# Altium schematic sheet logic_cpu_power.SchDoc: mcHF Pro Transceiver UI board
size A3; Author: Krassi Atanassov; CompanyName: MØNKA; Engineer: For radio amateurs experimentation, non-commercial use only. Thank you!; Revision: 0.8.2; SheetTotal: 18
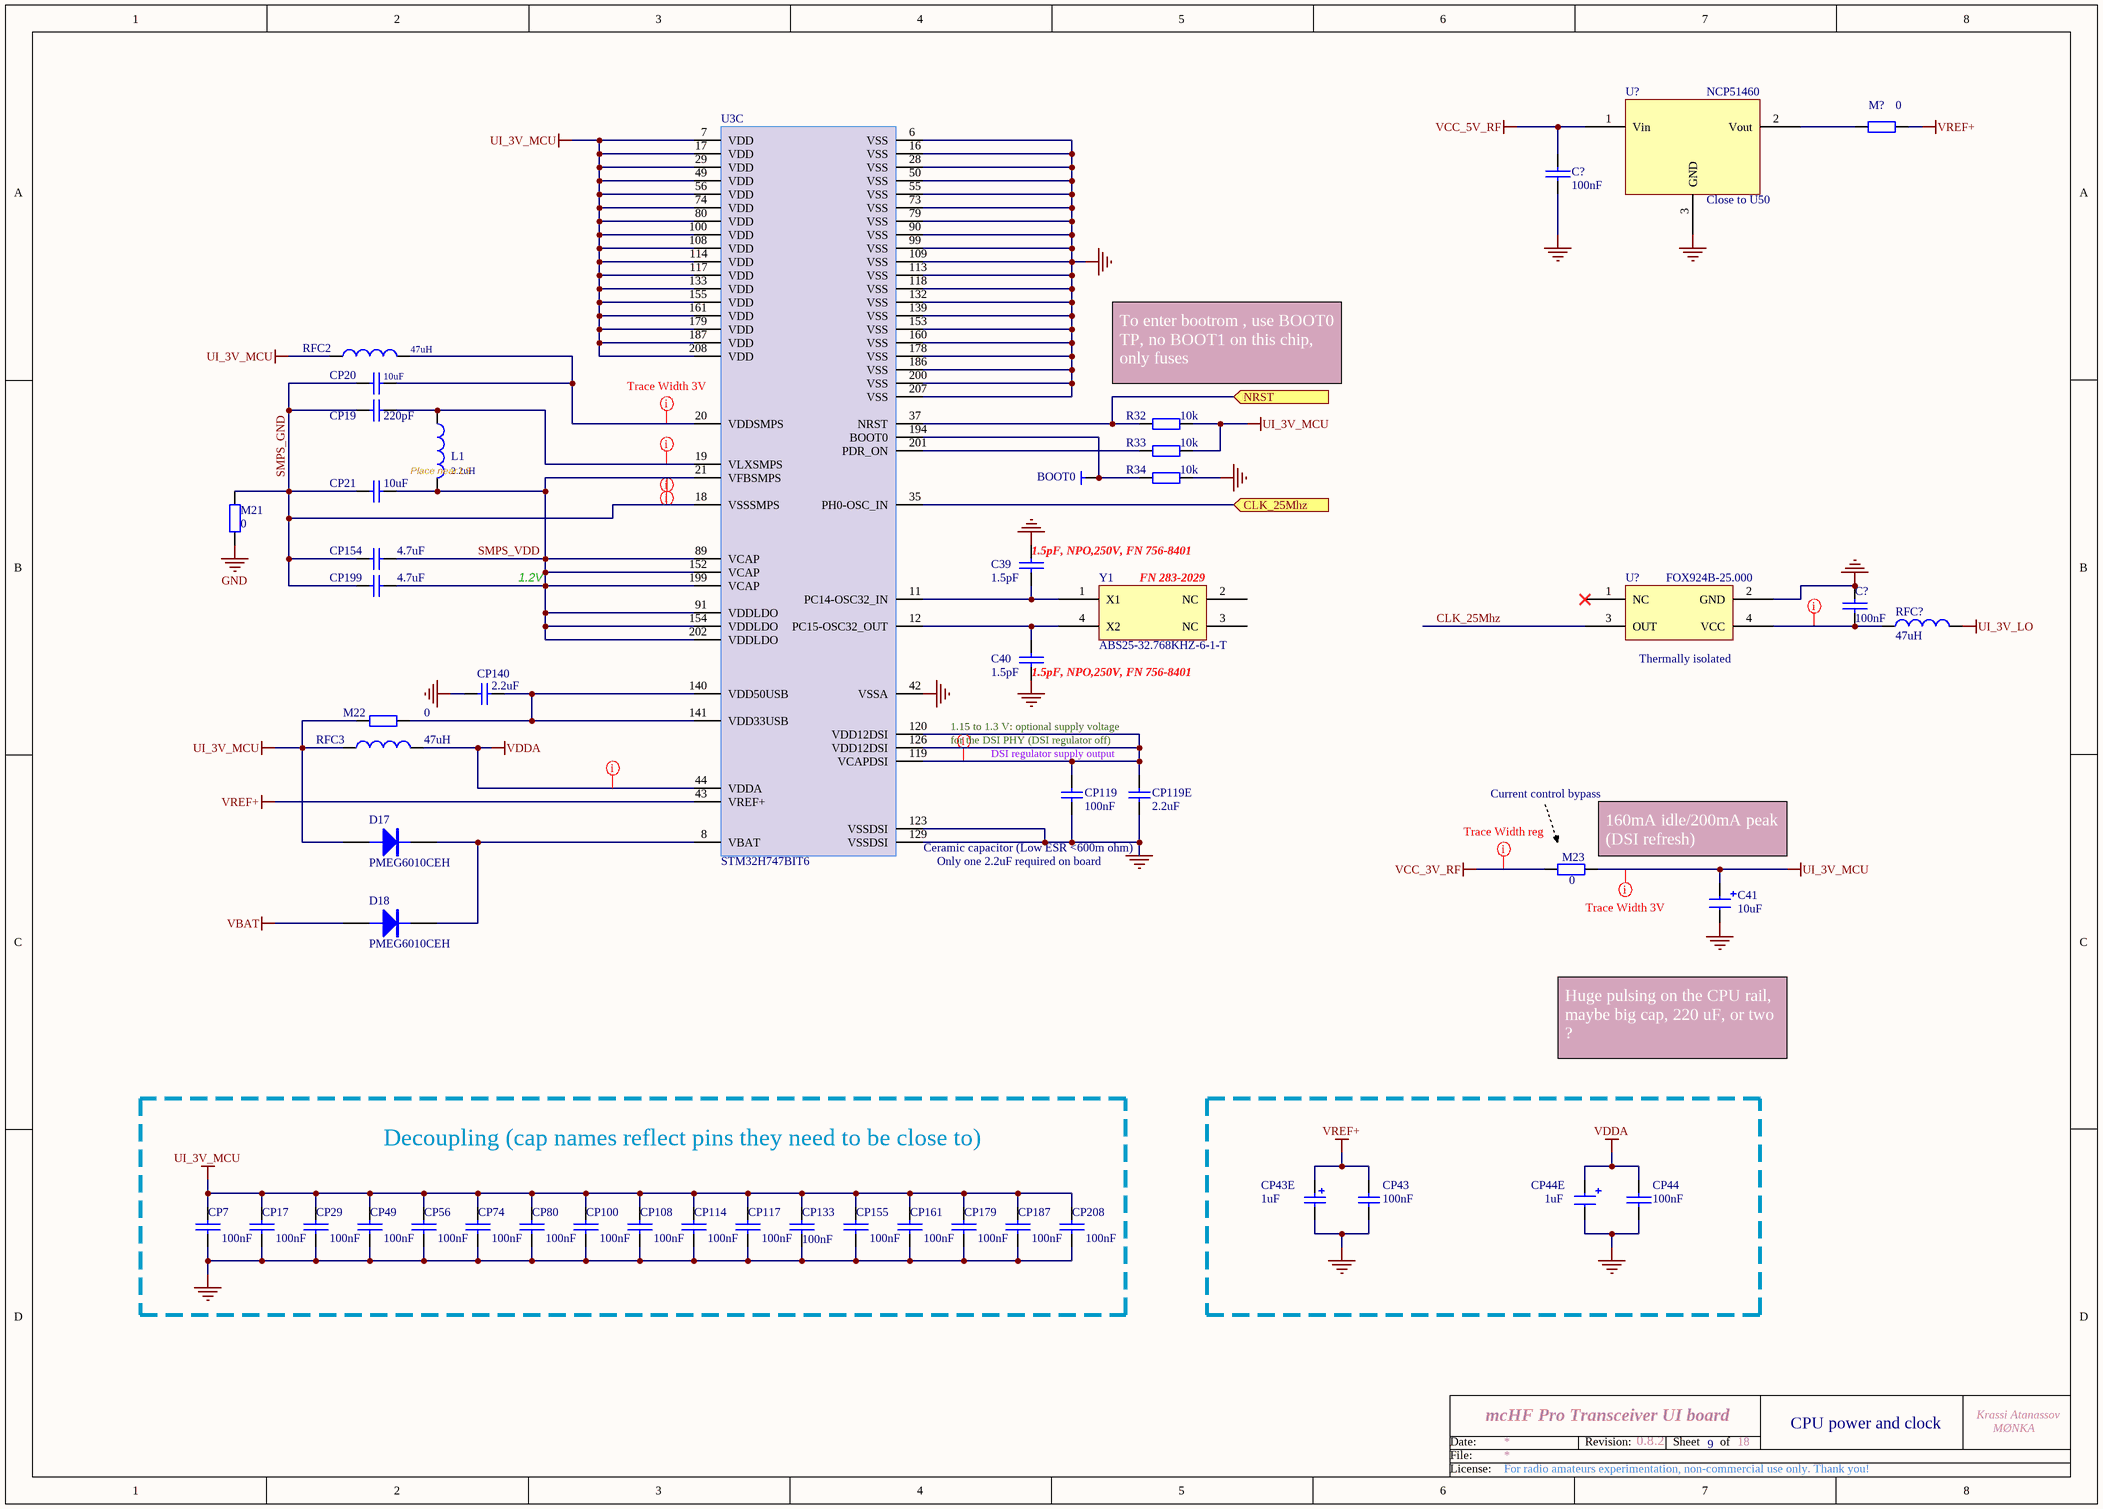
[diagram p0: logic_cpu_power.SchDoc]

## Parts
(Parts that share a designator on the sheet are numbered #1, #2 ... from top to bottom, then left to right.)
BOOT0  TP  [tp]  (value not drawn)  (no BOM)
C39  1.5pF  [0805]
C40  1.5pF  [0805]
C41  10uF  [1206_Elec_Cap]
C?#1  100nF  [0805]
C?#2  100nF  [0805]
CP7  100nF  [0805]
CP17  100nF  [0805]
CP19  220pF  [0805]
CP20  10uF  [0805]
CP21  10uF  [0805]
CP29  100nF  [0805]
CP43  100nF  [0805]
CP43E  1uF  [1206_Elec_Cap]
CP44  100nF  [0805]
CP44E  1uF  [1206_Elec_Cap]
CP49  100nF  [0805]
CP56  100nF  [0805]
CP74  100nF  [0805]
CP80  100nF  [0805]
CP100  100nF  [0805]
CP108  100nF  [0805]
CP114  100nF  [0805]
CP117  100nF  [0805]
CP119  100nF  [0805]
CP119E  2.2uF  [0805]
CP133  100nF  [0805]
CP140  2.2uF  [0805]
CP154  4.7uF  [0805]
CP155  100nF  [0805]
CP161  100nF  [0805]
CP179  100nF  [0805]
CP187  100nF  [0805]
CP199  4.7uF  [0805]
CP208  100nF  [0805]
D17  PMEG6010CEH  [SOD87]
D18  PMEG6010CEH  [SOD87]
L1  2.2uH  [0805]
M21  0  [0805]
M22  0  [0805]
M23  0  [0805]
M?  0  [0805]
R32  10k  [0805]
R33  10k  [0805]
R34  10k  [0805]
RFC2  47uH  [0805]
RFC3  47uH  [0805]
RFC?  47uH  [0805]
U3  STM32H747BIT6  [LQFP208-28x28x1.4]  (part C of 3)
U?#1  NCP51460  [SOT-23]
U?#2  FOX924B-25.000  [2SMX-3SMXB]
Y1  ABS25-32.768KHZ-6-1-T  [DSO-N4]

## Blocks framed on the sheet
Decoupling (cap names reflect pins they need to be close to): CP7 CP17 CP29 CP49 CP56 CP74 CP80 CP100 CP108 CP114 CP117 CP133 CP155 CP161 CP179 CP187 CP208

## Ports
CLK_25Mhz (in), NRST (in)

## Nets
GND: C39.2 C40.1 C41.2 C?#1.2 C?#2.1 CP7.2 CP17.2 CP29.2 CP43.1 CP43E.2 CP44.2 CP44E.2 CP49.2 CP56.2 CP74.2 CP80.2 CP100.2 CP108.2 CP114.2 CP117.2 CP119.2 CP119E.2 CP133.2 CP140.2 CP155.2 CP161.2 CP179.2 CP187.2 CP208.2 M21.2 R34.1 U3.6(VSS) U3.16(VSS) U3.28(VSS) U3.42(VSSA) U3.50(VSS) U3.55(VSS) U3.73(VSS) U3.79(VSS) U3.90(VSS) U3.99(VSS) U3.109(VSS) U3.113(VSS) U3.118(VSS) U3.123(VSSDSI) U3.129(VSSDSI) U3.132(VSS) U3.139(VSS) U3.153(VSS) U3.160(VSS) U3.178(VSS) U3.186(VSS) U3.200(VSS) U3.207(VSS) U?#1.3(GND) U?#2.2(GND)
UI_3V_LO: RFC?.2
UI_3V_MCU: C41.1 CP7.1 CP17.1 CP29.1 CP49.1 CP56.1 CP74.1 CP80.1 CP100.1 CP108.1 CP114.1 CP117.1 CP133.1 CP155.1 CP161.1 CP179.1 CP187.1 CP208.1 D17.1(A) M22.2 M23.1 R32.1 R33.1 RFC2.1 RFC3.1 U3.7(VDD) U3.17(VDD) U3.29(VDD) U3.49(VDD) U3.56(VDD) U3.74(VDD) U3.80(VDD) U3.100(VDD) U3.108(VDD) U3.114(VDD) U3.117(VDD) U3.133(VDD) U3.155(VDD) U3.161(VDD) U3.179(VDD) U3.187(VDD) U3.208(VDD)
VBAT: D18.1(A)
VCC_3V_RF: M23.2
VCC_5V_RF: C?#1.1 U?#1.1(Vin)
VDDA: CP44.1 CP44E.1 RFC3.2 U3.44(VDDA)
VREF+: CP43.2 CP43E.1 M?.1 U3.43(VREF+)
CLK_25Mhz: U3.35(PH0-OSC_IN) ; port CLK_25Mhz
CLK_25Mhz: U?#2.3(OUT)  [a separate net that carries the same name]
NRST: R32.2 U3.37(NRST) ; port NRST
SMPS_GND: CP19.2 CP20.1 CP21.1 CP154.1 CP199.1 M21.1 U3.18(VSSSMPS)
SMPS_VDD: CP21.2 CP154.2 CP199.2 L1.2 U3.21(VFBSMPS) U3.89(VCAP) U3.91(VDDLDO) U3.152(VCAP) U3.154(VDDLDO) U3.199(VCAP) U3.202(VDDLDO)
NetBOOT0_1: BOOT0.1 R34.2 U3.194(BOOT0)
NetC39_1: C39.1 U3.11(PC14-OSC32_IN) Y1.1(X1)
NetC40_2: C40.2 U3.12(PC15-OSC32_OUT) Y1.4(X2)
NetC?#2_2: C?#2.2 RFC?.1 U?#2.4(VCC)
NetCP19_1: CP19.1 L1.1 U3.19(VLXSMPS)
NetCP20_2: CP20.2 RFC2.2 U3.20(VDDSMPS)
NetCP119_1: CP119.1 CP119E.1 U3.119(VCAPDSI) U3.120(VDD12DSI) U3.126(VDD12DSI)
NetCP140_1: CP140.1 M22.1 U3.140(VDD50USB) U3.141(VDD33USB)
NetD17_2: D17.2(K) D18.2(K) U3.8(VBAT)
NetM?_2: M?.2 U?#1.2(Vout)
NetR33_2: R33.2 U3.201(PDR_ON)

Not connected (* = marked no-connect by the designer): U?#2 1(NC)*; Y1 2(NC) 3(NC)

## Layout directives
rule Width Constraint [Pref Width = 12mil    Min Width = 12mil    Max Width = 12mil]: NetC?#2_2, NetCP19_1, NetCP20_2, NetCP119_1, SMPS_GND, SMPS_VDD, UI_3V_MCU, VDDA
rule Width Constraint [Pref Width = 20mil    Min Width = 20mil    Max Width = 20mil]: VCC_3V_RF

## Notes on the sheet
- (near U?#1) Close to U50
- (near R32) To enter bootrom , use BOOT0 TP, no BOOT1 on this chip, only fuses
- (near CP21) Place near L3
- 1.2V
- (near C39) 1.5pF, NPO,250V, FN 756-8401
- (near Y1) FN 283-2029
- (near C40) 1.5pF, NPO,250V, FN 756-8401
- (near U?#2) Thermally isolated
- 1.15 to 1.3 V: optional supply voltage
- for the DSI PHY (DSI regulator off)
- DSI regulator supply output
- Ceramic capacitor (Low ESR <600m ohm)
- Current control bypass
- (near M23) 160mA idle/200mA peak (DSI refresh)
- Only one 2.2uF required on board
- Huge pulsing on the CPU rail, maybe big cap, 220 uF, or two ?
- 6
- CPU power and clock
- Date:
- File:
- Revision:
- Sheet
- of
- License:

## Library data of the parts
BOOT0 = TP: Test point
C39 = CAP: Capacitor; Order: FN 756-8401; QT Order: QCC-00266; QT Price: 0.045; Price: 0.341
C40 = CAP: Capacitor; Order: FN 756-8401; QT Order: QCC-00266; Price: 0.341
C41 = CAP-POL: Electrolitic capacitor; Notes: Tantalum capacitor; Price: 0.235
C?#1 = CAP: Capacitor; Order: FN 252-2090; QT Order: QCC-00154; Price: 0.068
C?#2 = CAP: Capacitor; Order: FN 174-0673; QT Order: QCC-00154; Price: 0.068
CP7 CP17 CP29 CP44 CP49 CP56 CP74 CP80 CP100 CP108 CP114 CP117 CP133 CP155 CP161 CP179 CP187 CP208 = CAP: Capacitor; Order: FN 282-1264; QT Order: QCC-00157; Price: 0.089
CP19 CP43 CP199 = Cap: Capacitor; Value: 10nF; Published: 8-Jun-2000; Revision: July-2002: Re-released for DXP Platform.; Publisher: Altium Limited
CP20 = Cap: Ceramic Capacitor; Published: 8-Jun-2000; Revision: July-2002: Re-released for DXP Platform.; Publisher: Altium Limited; Notes: Ceramic Capacitor
CP21 = Cap: Ceramic Capacitor; Value: 10nF; Published: 8-Jun-2000; Revision: July-2002: Re-released for DXP Platform.; Publisher: Altium Limited; Notes: Ceramic Capacitor
CP43E = Cap Pol1: Value: 10uF; Published: 8-Jun-2000; Revision: July-2002: Re-released for DXP Platform.; Publisher: Altium Limited
CP44E = CAP-POL: Electrolitic capacitor; Order: FN 145-7406; QT Order: QCC-00172; Price: 0.235
CP119 = CAP: Capacitor; Published: 8-Jun-2000; Revision: July-2002: Re-released for DXP Platform.; Publisher: Altium Limited; Value: 100nF
CP119E = CAP: Capacitor; Value: 100nF; Published: 8-Jun-2000; Revision: July-2002: Re-released for DXP Platform.; Publisher: Altium Limited
CP140 = CAP SMD 0603  X5R 1礔 25V 10%: 0603  X5R 1礔; Rated voltage: 25V; Tolerance: 10%; Manufacturer: *; Manufacturer P/N: *; Order code Farnell: 1288202RL; Value: 1礔; Power: *; Technology: X5R; Temperature  Factor: *; Temperature Max: +125癈; Temperature Min: -55癈; STS Code: *
CP154 = cap: Capacitor; Value: 100nF; Ordered by: Subcon; ECCN_US/EU: NA; Fitted: NO; Notes: Ceramic capacitor, low ESR; Published: 8-Jun-2000; Revision: July-2002: Re-released for DXP Platform.; Publisher: Altium Limited
D17 D18 = PMEG6010CEH: DIODE, SCHOTTKY, 1A, 60V, SOD-123F; QT Order: QCD-00034; Price: 0.085
L1 = Inductor: Power Inductor; Notes: maybe LQM2MPN2R2NG0? We already ordered this for the BMS test board, should have a code; Published: 8-Jun-2000; Revision: July-2002: Re-released for DXP Platform.; Publisher: Altium Limited
M21-M23 M? = RES: Resistor; Order: FN 933-3681; QT Order: QCR-00268; Price: 0.009
R32-R34 = RES: Resistor; Order: FN 146-9857; Price: 0.046
RFC2 RFC3 = Inductor: Value: 100uH; Published: 8-Jun-2000; Revision: July-2002: Re-released for DXP Platform.; Publisher: Altium Limited
RFC? = Inductor: Order: FN 166-9895; Price: 0.16
U3 = STM32H747BIT6: STM32H747BIT6 LQFP208; Order: FN 248-4976; Price: 10.97
U?#1 = NCP51460: 3.3V voltage reference, SOT-23
U?#2 = FOX924B-16.000: TCXO; Order: FN 206-3959; Price: 2.77
Y1 = SmdCrystal: 32kHz Crystal; Order: FN 283-2029; Price: 0.34